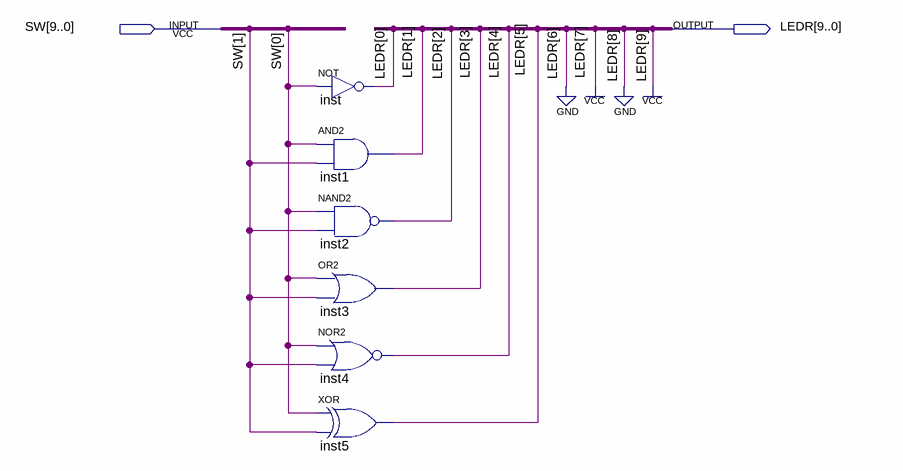
[diagram p0: schematic sheet]
// Quartus schematic logic_elements.bdf as structural Verilog: 6 symbols, 2 pins
module logic_elements (
  input  [9:0] SW,
  output [9:0] LEDR
);

  not inst (LEDR[0], SW[0]);
  and inst1 (LEDR[1], SW[0], SW[1]);
  nand inst2 (LEDR[2], SW[0], SW[1]);
  or inst3 (LEDR[3], SW[0], SW[1]);
  nor inst4 (LEDR[4], SW[0], SW[1]);
  xor inst5 (LEDR[5], SW[0], SW[1]);

  assign LEDR[9:6] = 4'b1010;
endmodule
